# EAGLE schematic sonPckg (EAGLE 7.2.0)
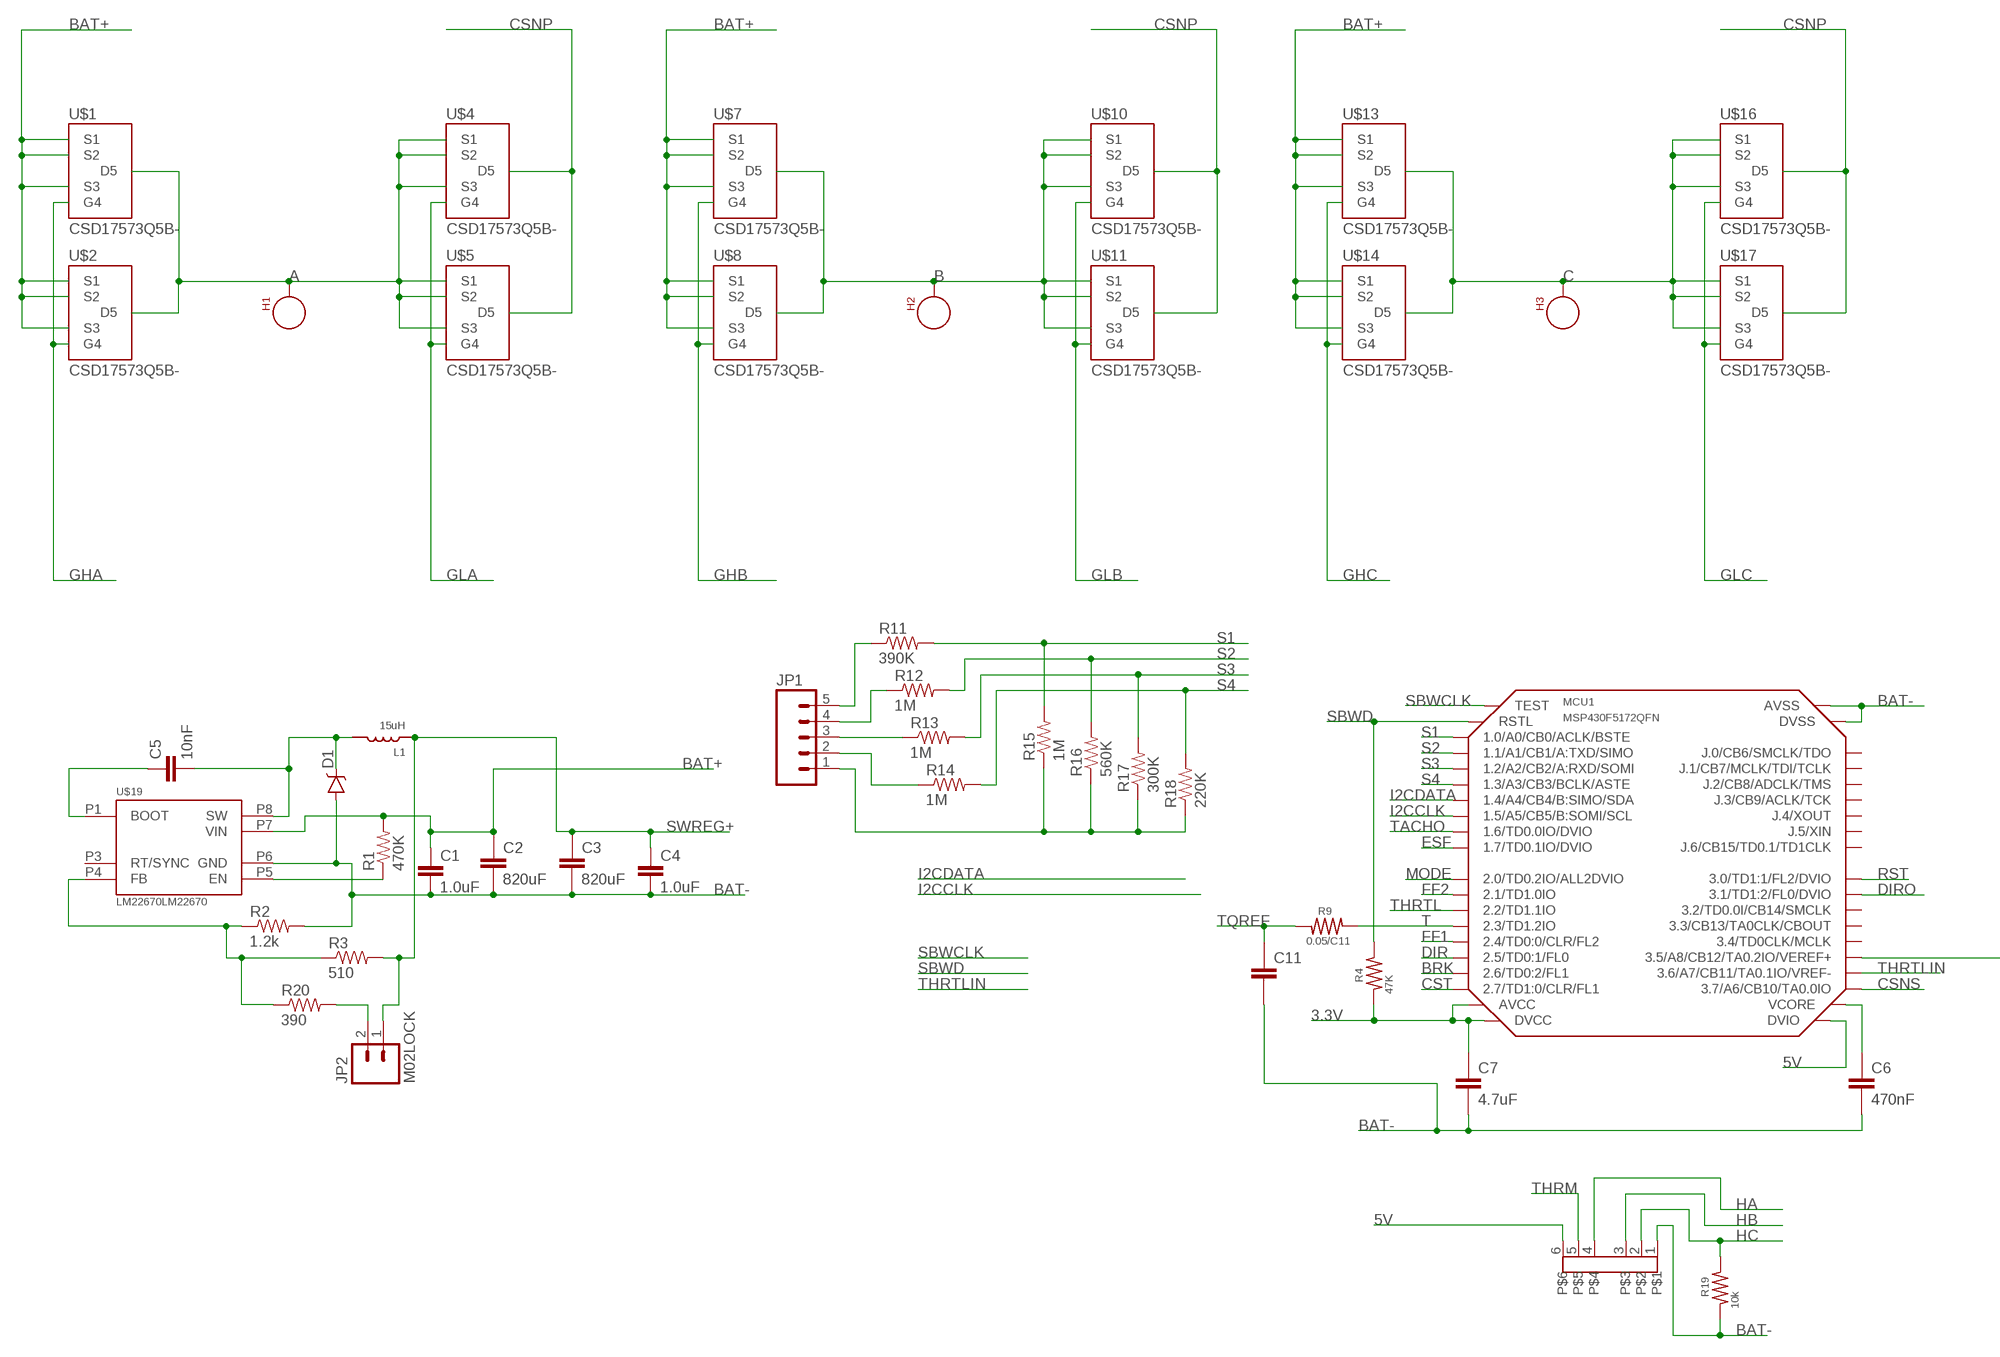
[diagram p0: schematic, sheet 1, part 1 of 2]
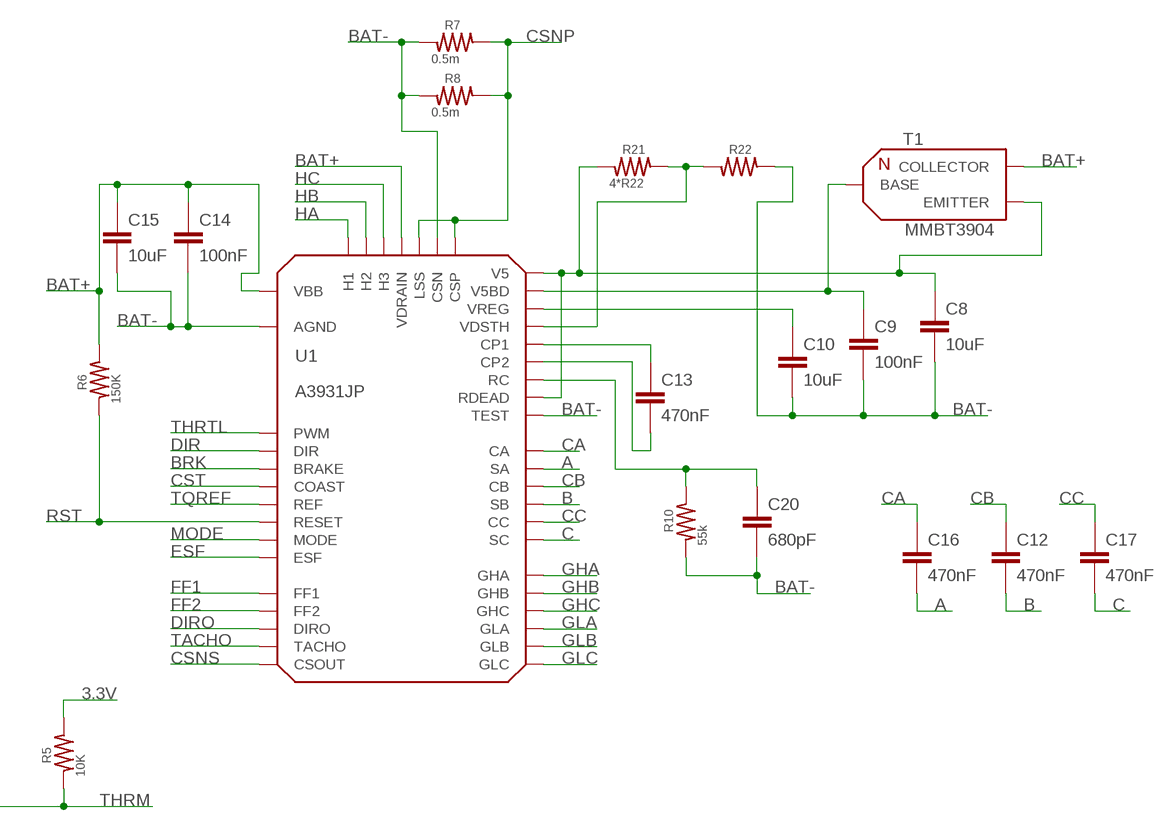
[diagram p1: schematic, sheet 1, part 2 of 2]

## Parts
C1  1.0uF  CAP0603-CAP  [0603-CAP]
C2  820uF  CHEMICONEGPA500ELL821MK30S821  [CHEMI-CON_K30_CAPACITOR]
C3  820uF  CHEMICONEGPA500ELL821MK30S821  [CHEMI-CON_K30_CAPACITOR]
C4  1.0uF  CAP0603-CAP  [0603-CAP]
C5  10nF  10NF/10000PF-50V-10%(0603)  [0603-CAP]
C6  470nF  0603CAP-1  [0603@1]
C7  4.7uF  0603CAP-1  [0603@1]
C8  10uF  0603CAP-1  [0603@1]
C9  100nF  0603CAP-1  [0603@1]
C10  10uF  0603CAP-1  [0603@1]
C11  0603CAP-1  [0603@1]
C12  470nF  CAP-0603  [0603]
C13  470nF  0603CAP-1  [0603@1]
C14  100nF  0603CAP-1  [0603@1]
C15  10uF  0603CAP-1  [0603@1]
C16  470nF  CAP-0603  [0603]
C17  470nF  CAP-0603  [0603]
C20  680pF  CAP-0603  [0603]
D1  NXPPMEG45A10EPDSCHOTTKY  [CFP15]
H1  SEW_HOLE  [SIMPLE_HOLE]
H2  SEW_HOLE  [SIMPLE_HOLE]
H3  SEW_HOLE  [SIMPLE_HOLE]
JP1  M05LOCK  [1X05_LOCK]
JP2  M02LOCK  [1X02_LOCK]
L1  15uH  WURTH7447709150150  [WURTH_WE-PD_INDUCTOR]
MCU1  MSP430F5172QFN  [QFN-40]
R1  470K  RESISTOR0603-RES  [0603-RES]
R2  1.2k  RESISTOR0603-RES  [0603-RES]
R3  510  RESISTOR0603-RES  [0603-RES]
R4  47K  0603RES-1  [0603@1]
R5  10K  0603RES-1  [0603@1]
R6  150K  0603RES-1  [0603@1]
R7  0.5m  RESISTOR-2512  [2512]
R8  0.5m  RESISTOR-2512  [2512]
R9  0.05/C11  0603RES-1  [0603@1]
R10  55k  RESISTOR-0603  [0603]
R11  390K  RESISTOR0603  [0603-RES]
R12  1M  RESISTOR0603  [0603-RES]
R13  1M  RESISTOR0603  [0603-RES]
R14  1M  RESISTOR0603  [0603-RES]
R15  1M  RESISTOR0603  [0603-RES]
R16  560K  RESISTOR0603  [0603-RES]
R17  300K  RESISTOR0603  [0603-RES]
R18  220K  RESISTOR0603  [0603-RES]
R19  10k  RESISTOR-0603  [0603]
R20  390  RESISTOR0603  [0603-RES]
R21  4*R22  RESISTOR-0603  [0603]
R22  RESISTOR-0603  [0603]
T1  MMBT3904  NTRANSISTOR-MMBT3904  [SOT-23]
U1  A3931JP  [LQFP-48]
U$1  CSD17573Q5B-  [SON5X6]
U$2  CSD17573Q5B-  [SON5X6]
U$4  CSD17573Q5B-  [SON5X6]
U$5  CSD17573Q5B-  [SON5X6]
U$7  CSD17573Q5B-  [SON5X6]
U$8  CSD17573Q5B-  [SON5X6]
U$10  CSD17573Q5B-  [SON5X6]
U$11  CSD17573Q5B-  [SON5X6]
U$13  CSD17573Q5B-  [SON5X6]
U$14  CSD17573Q5B-  [SON5X6]
U$16  CSD17573Q5B-  [SON5X6]
U$17  CSD17573Q5B-  [SON5X6]
U$19  LM22670LM22670  [POWERPAD8]
U$23  JST6X1.5  [JST1.5X6]

## Nets
3.3V: C7.P$1 MCU1.P27(DVCC) MCU1.P37(AVCC) R4.P$1 R5.P$2
5V: MCU1.P17(DVIO) U$23.6
A: C16.P$2 H1.P$1 U1.P31(SA) U$1.5(D5) U$2.5(D5) U$4.1(S1) U$4.2(S2) U$4.3(S3) U$5.1(S1) U$5.2(S2) U$5.3(S3)
B: C12.P$2 H2.P$1 U1.P28(SB) U$7.5(D5) U$8.5(D5) U$10.1(S1) U$10.2(S2) U$10.3(S3) U$11.1(S1) U$11.2(S2) U$11.3(S3)
BAT+: C1.1 C2.P$1 C14.P$1 C15.P$1 R1.2 R6.P$2 T1.P$2(COLLECTOR) U1.P24(VDRAIN) U1.P45(VBB) U$1.1(S1) U$1.2(S2) U$1.3(S3) U$2.1(S1) U$2.2(S2) U$2.3(S3) U$7.1(S1) U$7.2(S2) U$7.3(S3) U$8.1(S1) U$8.2(S2) U$8.3(S3) U$13.1(S1) U$13.2(S2) U$13.3(S3) U$14.1(S1) U$14.2(S2) U$14.3(S3) U$19.P7(VIN)
BAT-: C1.2 C2.P$2 C3.P$2 C4.2 C6.P$2 C7.P$2 C8.P$2 C9.P$2 C10.P$2 C11.P$2 C14.P$2 C15.P$2 C20.P$2 D1.P$1(A) D1.P$2(A) MCU1.P18(DVSS) MCU1.P26(DVSS) MCU1.P40(AVSS) MCU1.P$42(DVSS) MCU1.P$43(DVSS) MCU1.P$44(DVSS) MCU1.P$45(DVSS) MCU1.P$46(DVSS) MCU1.P$47(DVSS) MCU1.P$48(DVSS) MCU1.P$49(DVSS) MCU1.P$50(DVSS) MCU1.P$51(DVSS) MCU1.P$52(DVSS) MCU1.P$53(DVSS) MCU1.P$54(DVSS) MCU1.P$55(DVSS) MCU1.P$56(DVSS) MCU1.P$57(DVSS) MCU1.P$58(DVSS) MCU1.P$59(DVSS) MCU1.P$60(DVSS) MCU1.P$61(DVSS) MCU1.P$62(DVSS) MCU1.P$63(DVSS) MCU1.P$64(DVSS) MCU1.P$65(DVSS) MCU1.P$66(DVSS) MCU1.THRM(DVSS) R2.2 R7.P$1 R8.P$1 R10.P$1 R19.P$1 R22.P$2 U1.P17(TEST) U1.P21(CSN) U1.P41(AGND) U1.THRM(AGND) U$19.P6(GND) U$23.1
BRK: U1.P8(BRAKE)
C: C17.P$2 H3.P$1 U1.P25(SC) U$13.5(D5) U$14.5(D5) U$16.1(S1) U$16.2(S2) U$16.3(S3) U$17.1(S1) U$17.2(S2) U$17.3(S3)
CA: C16.P$1 U1.P33(CA)
CB: C12.P$1 U1.P30(CB)
CC: C17.P$1 U1.P27(CC)
CSNP: R7.P$2 R8.P$2 U1.P22(CSP) U1.P38(LSS) U$4.5(D5) U$5.5(D5) U$10.5(D5) U$11.5(D5) U$16.5(D5) U$17.5(D5)
CSNS: U1.P19(CSOUT)
CST: U1.P46(COAST)
DIR: U1.P9(DIR)
DIRO: MCU1.P24(3.1/TD1:2/FL0/DVIO) U1.P44(DIRO)
ESF: U1.P39(ESF)
FF1: MCU1.P19(2.4/TD0:0/CLR/FL2) U1.P6(FF1)
FF2: MCU1.P14(2.1/TD1.0IO) U1.P5(FF2)
GHA: U1.P32(GHA) U$1.4(G4) U$2.4(G4)
GHB: U1.P29(GHB) U$7.4(G4) U$8.4(G4)
GHC: U1.P26(GHC) U$13.4(G4) U$14.4(G4)
GLA: U1.P36(GLA) U$4.4(G4) U$5.4(G4)
GLB: U1.P35(GLB) U$10.4(G4) U$11.4(G4)
GLC: U1.P34(GLC) U$16.4(G4) U$17.4(G4)
HA: U1.P10(H1) U$23.4
HB: U1.P11(H2) U$23.3
HC: R19.P$2 U1.P12(H3) U$23.2
I2CCLK: MCU1.P6(1.5/A5/CB5/B:SOMI/SCL)
I2CDATA: MCU1.P5(1.4/A4/CB4/B:SIMO/SDA)
MODE: U1.P15(MODE)
N$1: C6.P$1 MCU1.P25(VCORE)
N$2: C5.2 D1.P$3(C) L1.P$1 U$19.P8(SW)
N$3: C5.1 U$19.P1(BOOT)
N$4: C20.P$1 R10.P$2 U1.P16(RC)
N$5: C8.P$1 R21.P$1 T1.P$3(EMITTER) U1.P4(V5) U1.P18(RDEAD)
N$6: R1.1 U$19.P5(EN)
N$7: R2.1 R3.1 R20.1 U$19.P4(FB)
N$8: C9.P$1 T1.P$1(BASE) U1.P3(V5BD)
N$9: C10.P$1 U1.P40(VREG)
N$10: C13.P$1 U1.P42(CP1)
N$11: C13.P$2 U1.P43(CP2)
N$13: JP1.5 R11.1
N$14: JP1.4 R12.1
N$15: JP1.3 R13.1
N$16: JP1.2 R14.1
N$21: JP2.2 R20.2
N$23: JP1.1 R15.1 R16.1 R17.1 R18.1
RST: R6.P$1 U1.P2(RESET)
S1: MCU1.P1(1.0/A0/CB0/ACLK/BSTE) R11.2 R15.2
S2: MCU1.P2(1.1/A1/CB1/A:TXD/SIMO) R12.2 R16.2
S3: MCU1.P3(1.2/A2/CB2/A:RXD/SOMI) R13.2 R17.2
S4: MCU1.P4(1.3/A3/CB3/BCLK/ASTE) R14.2 R18.2
SBWCLK: MCU1.P32(TEST)
SBWD: MCU1.P33(RSTL) R4.P$2
SWREG+: C3.P$1 C4.1 JP2.1 L1.P$2 R3.2
T: MCU1.P16(2.3/TD1.2IO) R9.P$2
TACHO: MCU1.P11(1.6/TD0.0IO/DVIO) U1.P7(TACHO)
THRM: MCU1.P34(3.5/A8/CB12/TA0.2IO/VEREF+) R5.P$1 U$23.5
THRTL: U1.P14(PWM)
THRTLIN: MCU1.P35(3.6/A7/CB11/TA0.1IO/VREF-)
TQREF: C11.P$1 R9.P$1 U1.P20(REF)
VDSTH: R21.P$2 R22.P$1 U1.P23(VDSTH)
Unconnected: MCU1.P7(J.0/CB6/SMCLK/TDO) MCU1.P8(J.1/CB7/MCLK/TDI/TCLK) MCU1.P9(J.2/CB8/ADCLK/TMS) MCU1.P10(J.3/CB9/ACLK/TCK) MCU1.P12(1.7/TD0.1IO/DVIO) MCU1.P13(2.0/TD0.2IO/ALL2DVIO) MCU1.P15(2.2/TD1.1IO) MCU1.P20(2.5/TD0:1/FL0) MCU1.P21(2.6/TD0:2/FL1) MCU1.P22(2.7/TD1:0/CLR/FL1) MCU1.P23(3.0/TD1:1/FL2/DVIO) MCU1.P28(J.6/CB15/TD0.1/TD1CLK) MCU1.P29(3.2/TD0.0I/CB14/SMCLK) MCU1.P30(3.3/CB13/TA0CLK/CBOUT) MCU1.P31(3.4/TD0CLK/MCLK) MCU1.P36(3.7/A6/CB10/TA0.0IO) MCU1.P38(J.4/XOUT) MCU1.P39(J.5/XIN) U$19.P3(RT/SYNC)

## Library data of the parts
C1 C4 = SparkFun-Capacitors:CAP: Capacitor Standard 0603 ceramic capacitor, and 0.1" leaded capacitor.
C2 C3 = Adams:CHEMICONEGPA500ELL821MK30S
C5 = SparkFun-Capacitors:10NF/10000PF-50V-10%(0603): CAP-00867; PROD_ID: CAP-00867
C6-C11 C13-C15 = Adams:0603CAP
C12 C16 C17 C20 = Adams:CAP
D1 = Adams:NXPPMEG45A10EPD
H1-H3 = LilyPad-Wearables:SEW_HOLE: Simple sew-hole .1" diameter hole with 20mil annular ring
JP1 = SparkFun-Connectors:M05: Header 5 Standard 5-pin 0.1" header. Use with straight break away headers (SKU : PRT-00116), right angle break away headers (PRT-00553), swiss pins (PRT-00743), machine pins (PRT-00117), and female headers (PRT-00115). Molex polarized connector foot print use with SKU : PRT-08230 with associated crimp pins and housings.
JP2 = SparkFun-Connectors:M02: Standard 2-pin 0.1" header. Use with - straight break away headers ( PRT-00116) - right angle break away headers (PRT-00553) - swiss pins (PRT-00743) - machine pins (PRT-00117) - female headers (PRT-00115) Molex polarized connector foot print use with: PRT-08233 with associated crimp pins and housings. 2.54_SCREWTERM for use with PRT-10571. 3.5mm Screw Terminal footprints for PRT-08084 5mm Screw Terminal footprints for use with PRT-08432
L1 = Adams:WURTH7447709150
MCU1 = Adams:MSP430F5172
R1-R3 R11-R18 R20 = SparkFun-Resistors:RESISTOR: Resistor Basic schematic elements and footprints for 0603, 1206, and PTH resistors.
R4-R6 R9 = Adams:0603RES
R7 R8 R10 R19 R21 R22 = Adams:RESISTOR
T1 = Adams:NTRANSISTOR: SOT-23
U1 = temp:A3931
U$1 U$2 U$4 U$5 U$7 U$8 U$10 U$11 U$13 U$14 U$16 U$17 = Adams:CSD17573Q5B
U$19 = Adams:LM22670
U$23 = Adams:JST6